# Altium schematic sheet 对射光电接收板-友商方案-手抄版20260609.SchDoc
size A2
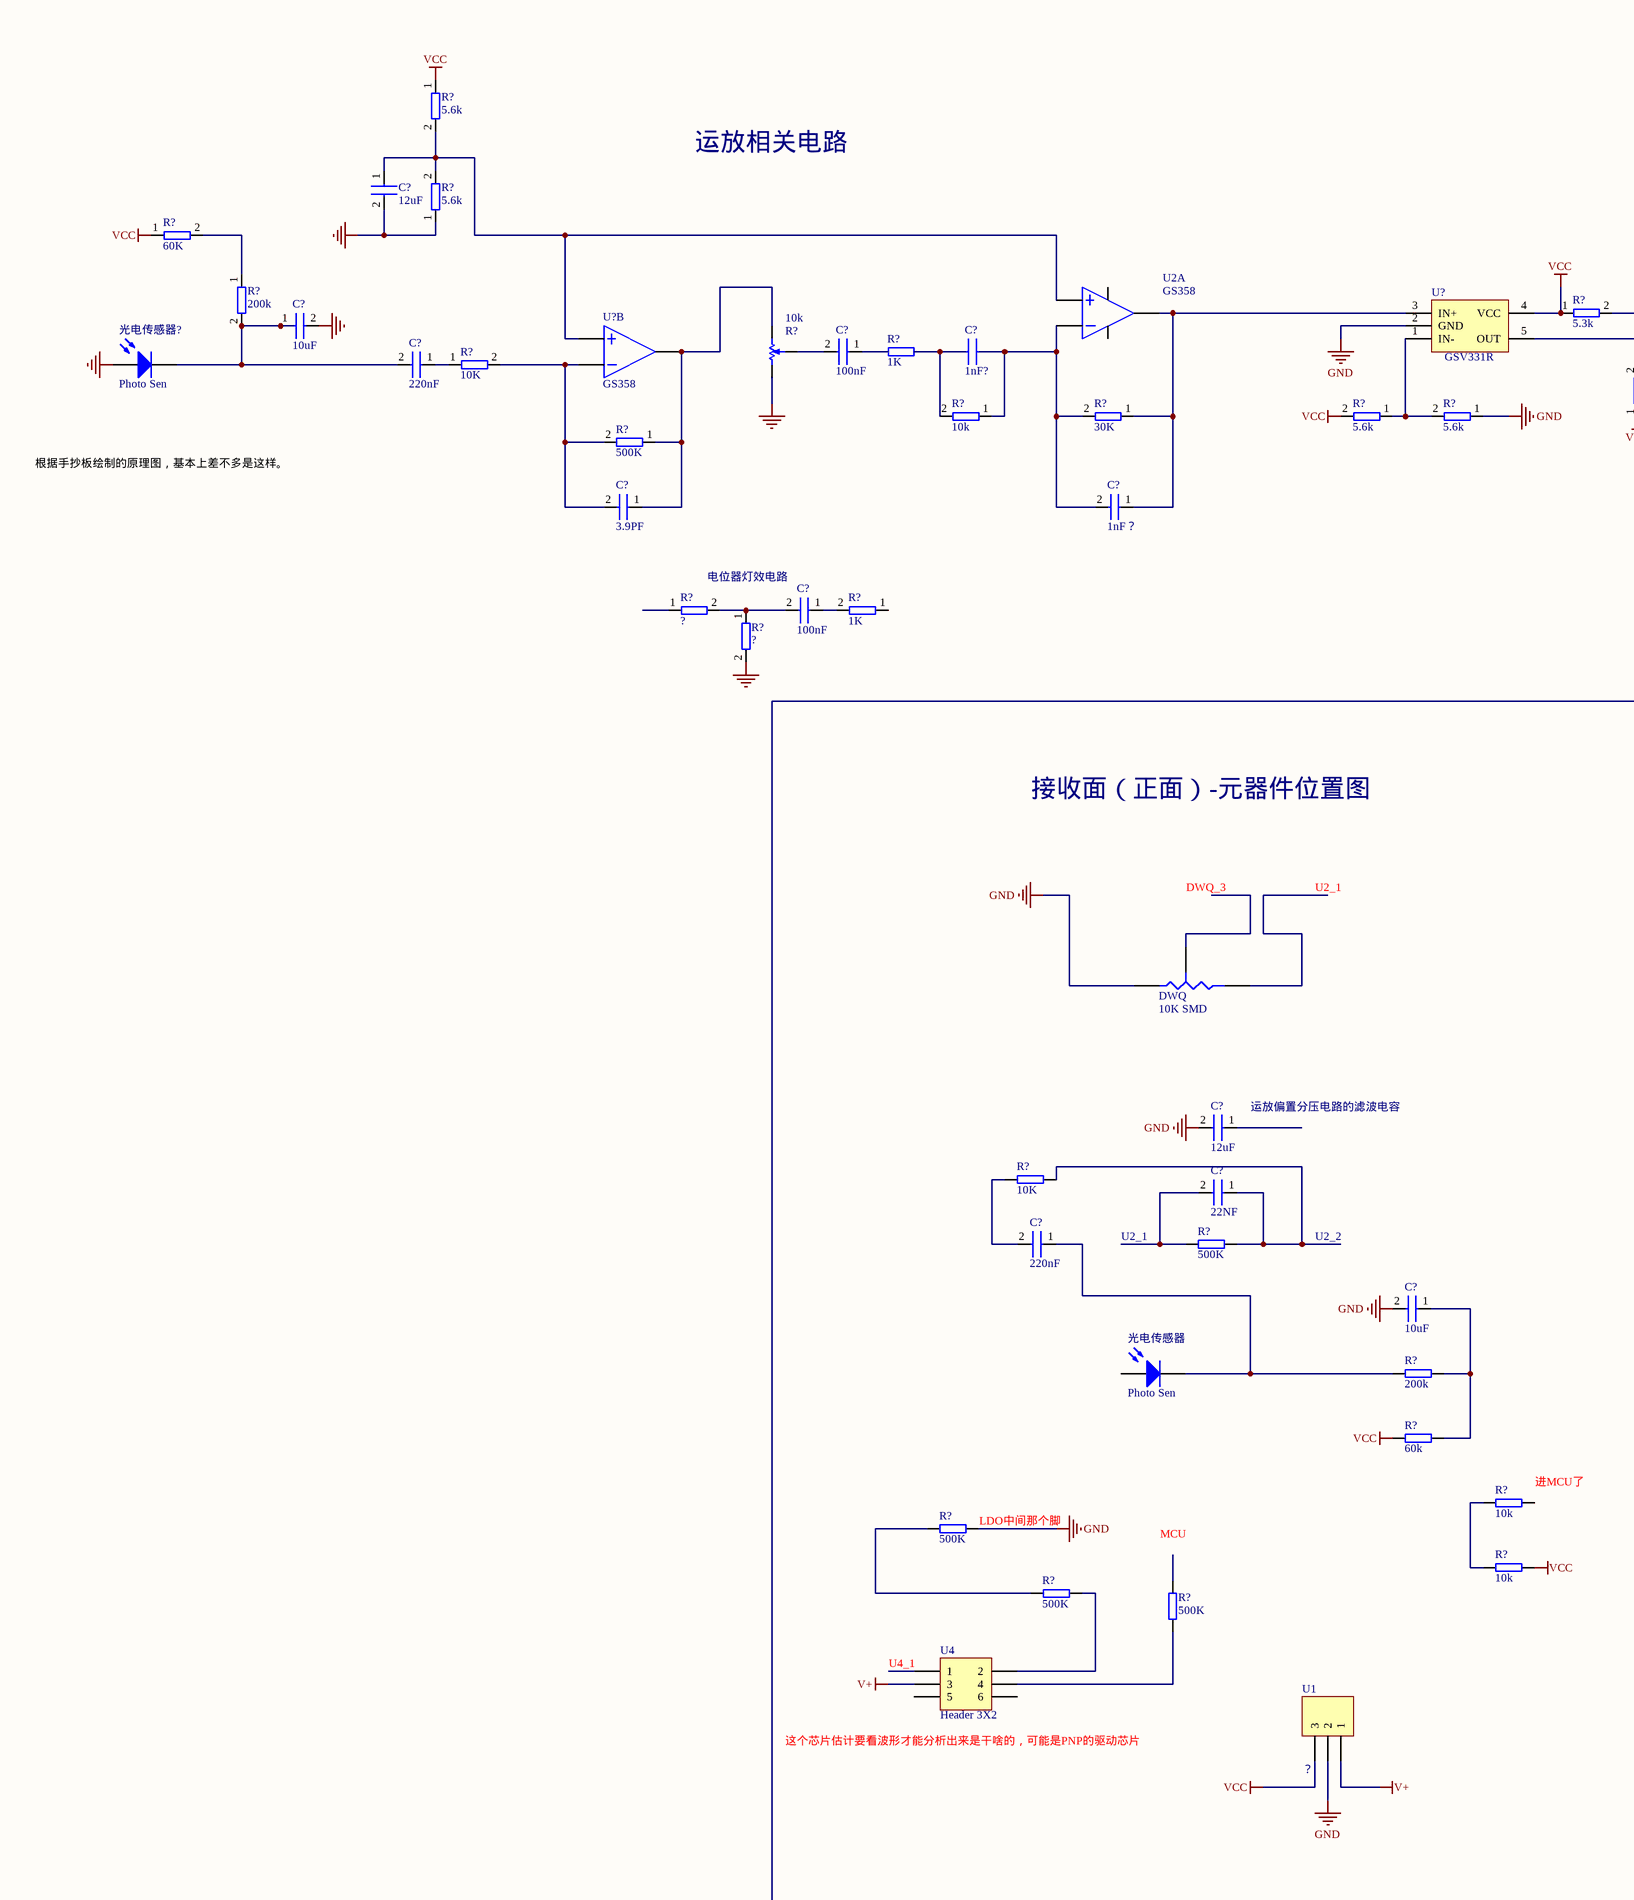
[diagram p0: 对射光电接收板-友商方案-手抄版20260609.SchDoc, left]
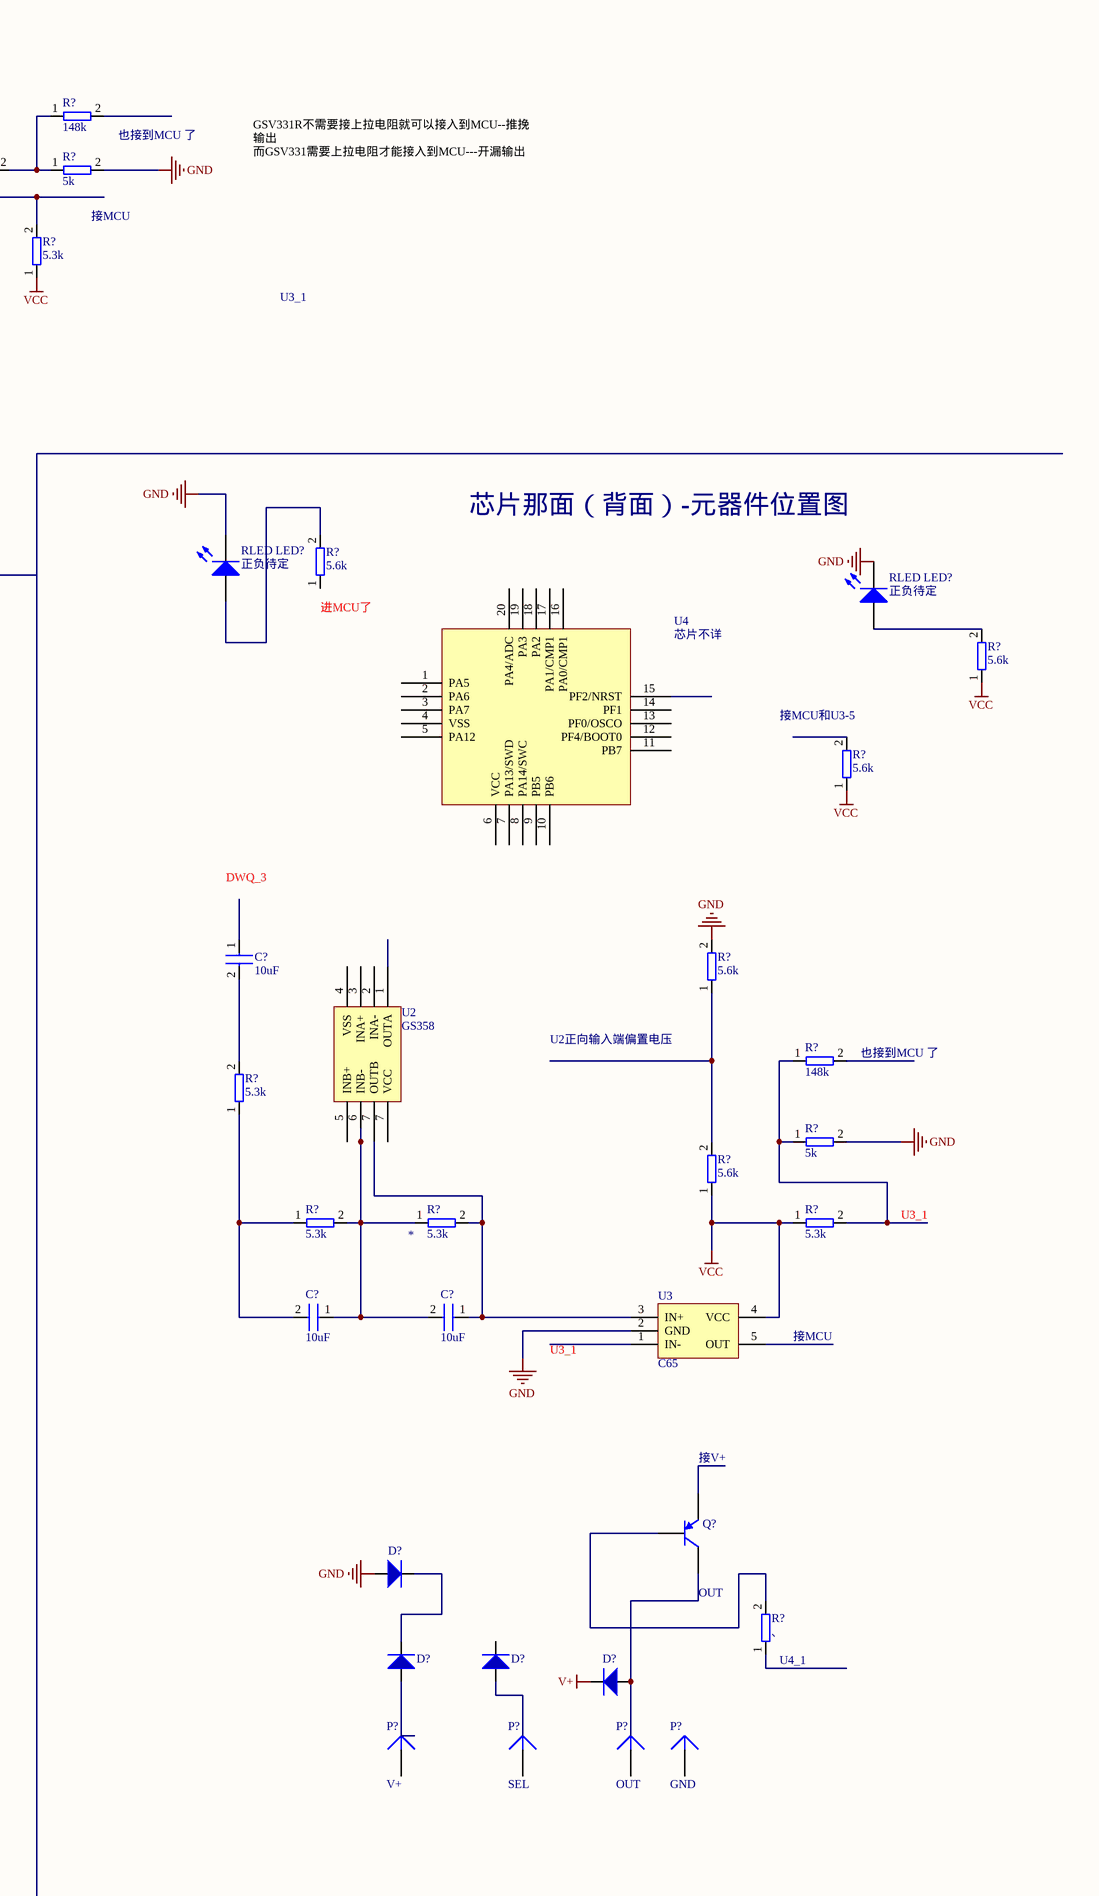
[diagram p1: 对射光电接收板-友商方案-手抄版20260609.SchDoc, right]

## Parts
(Parts that share a designator on the sheet are numbered #1, #2 ... from top to bottom, then left to right.)
5.3k  *  Designator: R?
C?#1  12uF
C?#2  10uF
C?#3  100nF
C?#4  1nF?
C?#5  220nF
C?#6  3.9PF
C?#7  1nF？
C?#8  100nF
C?#9  10uF
C?#10  12uF
C?#11  22NF
C?#12  220nF
C?#13  10uF
C?#14  10uF
C?#15  10uF
D?#1  (no value)
D?#2  (no value)
D?#3  (no value)
D?#4  (no value)
DWQ  value 10K SMD  [VR3]  (hidden comment: Res Tap)
P?#1  V+  [PIN1]
P?#2  SEL  [PIN1]
P?#3  OUT  [PIN1]
P?#4  GND  [PIN1]
Q?  PNP  [SOT-23B_L]  (value not drawn)
R?#1  5.6k
R?#2  5.6k
R?#3  60K
R?#4  148k
R?#5  200k
R?#6  5.3k
R?#7  5k
R?#8  10k  [POT4MM-2]
R?#9  1K
R?#10  10K
R?#11  10k
R?#12  30K
R?#13  5.6k
R?#14  5.6k
R?#15  5.3k
R?#16  500K
R?#17  ?
R?#18  ?
R?#19  1K
R?#20  5.6k
R?#21  5.6k
R?#22  5.6k
R?#23  5.6k
R?#24  148k
R?#25  10K
R?#26  5.3k
R?#27  500K
R?#28  5k
R?#29  5.6k
R?#30  5.3k
R?#31  5.3k
R?#32  200k
R?#33  60k
R?#34  10k
R?#35  500K
R?#36  10k
R?#37  500K
R?#38  500K
R?#39  、
RLED_LED?#1  正负待定  [LED-0]
RLED_LED?#2  正负待定  [LED-0]
U1  ？  [HDR1X3]
U2#1  GS358  [SOP-8]  (part A of 2)
U2#2  GS358
U3  C65  [SC70]
U4#1  芯片不详
U4#2  Header 3X2  [HDR2X3]
U?#1  GSV331R  [SC70]
U?#2  GS358  [SOP-8]  (part B of 2)
光电传感器  Photo Sen  [PIN2]
光电传感器?  Photo Sen  [PIN2]

## Nets
GND: C?#1.2 C?#2.2 C?#10.2 C?#13.2 D?#1.1 DWQ.1(A) R?#2.1 R?#7.2 R?#8.CCW(-) R?#14.1 R?#18.2 R?#23.2 R?#28.2 R?#35.2 RLED_LED?#1.2(K) RLED_LED?#2.2(K) U1.2 U3.2(GND) U?#1.2(GND) 光电传感器?.1(A)
V+: D?#4.2 U1.1 U4#2.3
VCC: R?#1.1 R?#3.1 R?#6.1 R?#13.2 R?#15.1 R?#21.1 R?#22.1 R?#29.1 R?#31.1 R?#33.1 R?#36.2 U1.3 U3.4(VCC) U?#1.4(VCC)
Net5.3k_1: 5.3k.1 C?#14.1 C?#15.2 R?#30.2 U2#2.6(INB-)
Net5.3k_2: 5.3k.2 C?#15.1 U2#2.7(OUTB) U3.3(IN+)
NetC?#1_1: C?#1.1 R?#1.2 R?#2.2 U2#1.3 U?#2.5
NetC?#2_1: C?#2.1 C?#5.2 R?#5.2 光电传感器?.2(K)
NetC?#3_2: C?#3.2 R?#8.W
NetC?#5_1: C?#5.1 R?#10.1
NetC?#6_1: C?#6.1 R?#8.CW(+) R?#16.1 U?#2.7
NetC?#6_2: C?#6.2 R?#10.2 R?#16.2 U?#2.6
NetC?#7_1: C?#7.1 R?#12.1 U2#1.1 U?#1.3(IN+)
NetC?#7_2: C?#7.2 R?#11.1 R?#12.2 U2#1.2
NetC?#8_1: C?#8.1 R?#19.2
NetC?#8_2: C?#8.2 R?#17.2 R?#18.1
NetC?#9_2: C?#9.2 R?#26.2
NetC?#11_1: C?#11.1 R?#25.2 R?#27.2
NetC?#11_2: C?#11.2 R?#27.1
NetC?#12_1: C?#12.1 R?#32.1 光电传感器.2(K)
NetC?#12_2: C?#12.2 R?#25.1
NetC?#13_1: C?#13.1 R?#32.2 R?#33.2
NetC?#14_2: C?#14.2 R?#26.1 R?#30.1
NetD?#1_2: D?#1.2 D?#2.2
NetD?#4_1: D?#4.1 Q?.1(C)
NetQ?_2: Q?.2(B) R?#39.2
NetR?#3_2: R?#3.2 R?#5.1
NetR?#4_1: R?#4.1 R?#6.2 R?#7.1
NetR?#13_1: R?#13.1 R?#14.2 U?#1.1(IN-)
NetR?#15_2: R?#15.2 U?#1.5(OUT)
NetR?#20_2: R?#20.2 RLED_LED?#1.1(A)
NetR?#21_2: R?#21.2 RLED_LED?#2.1(A)
NetR?#23_1: R?#23.1 R?#29.2
NetR?#24_1: R?#24.1 R?#28.1 R?#31.2
NetR?#34_1: R?#34.1 R?#36.1
NetR?#35_1: R?#35.1 R?#37.1
NetR?#37_2: R?#37.2 U4#2.2
NetR?#38_1: R?#38.1 U4#2.4

Not connected (* = marked no-connect by the designer): C?#3 1; C?#4 1 2; C?#9 1; C?#10 1; D?#2 1; D?#3 1 2; DWQ 2(B) 3(TAP); P?#1 1; P?#2 1; P?#3 1; P?#4 1; Q? 3(E); R?#4 2; R?#9 1 2; R?#11 2; R?#17 1; R?#19 1; R?#20 1; R?#22 2; R?#24 2; R?#34 2; R?#38 2; R?#39 1; U2#1 4 8; U2#2 1(OUTA) 2(INA-) 3(INA+) 4(VSS) 5(INB+); U3 1(IN-) 5(OUT); U4#1 1(PA5) 2(PA6) 3(PA7) 4(VSS) 5(PA12) 6(VCC) 7(PA13/SWD) 8(PA14/SWC) 9(PB5) 10(PB6) 11(PB7) 12(PF4/BOOT0) 13(PF0/OSCO) 14(PF1) 15(PF2/NRST) 16(PA0/CMP1) 17(PA1/CMP1) 18(PA2) 19(PA3) 20(PA4/ADC); U4#2 1 5 6; 光电传感器 1(A)

## Notes on the sheet
- 运放相关电路
- (near R?#4) 也接到MCU 了
- (near R?#7) 接MCU
- GSV331R不需要接上拉电阻就可以接入到MCU--推挽输出
  而GSV331需要上拉电阻才能接入到MCU---开漏输出
- U3_1
- (near R?#17) 电位器灯效电路
- 芯片那面（背面）-元器件位置图
- 根据手抄板绘制的原理图，基本上差不多是这样。
- (near R?#20) 进MCU了
- 接收面（正面）-元器件位置图
- (near R?#22) 接MCU和U3-5
- DWQ_3
- U2_1
- (near C?#10) 运放偏置分压电路的滤波电容
- U2正向输入端偏置电压
- (near R?#24) 也接到MCU 了
- U2_2
- (near R?#34) 进MCU了
- 接MCU
- (near R?#35) LDO中间那个脚
- MCU
- 接V+
- (near U4#2) U4_1
- OUT
- (near U4#2) 这个芯片估计要看波形才能分析出来是干啥的，可能是PNP的驱动芯片
- (near R?#39) U4_1

## Library data of the parts
5.3k R?#1-R?#7 R?#9-R?#39 = RES
C?#1-C?#15 = CAP
D?#1-D?#4 = D
DWQ = Res Tap: Tapped Resistor; Sim Note: Enter the Resistance value and the set point into parameter fields.; Set Position: 0.5; Published: 24-Mar-1999; LatestRevisionDate: 17-Jul-2002; LatestRevisionNote: Re-released for DXP Platform.; PackageReference: VR3; Publisher: Altium Limited; PackageDescription: Variable Resistor, Thru-Hole; 3 Leads
P?#1-P?#4 = Plug: LatestRevisionDate: 17-Jul-2002; LatestRevisionNote: Re-released for DXP Platform.; Publisher: Altium Limited
Q? = PNP: PNP Bipolar Transistor; Published: 8-Jun-2000; LatestRevisionDate: 29-May-2009; LatestRevisionNote: IPC-7351 Footprint Added.; PackageVersion: Aug-1999; PackageReference: SOT-23B; Publisher: Altium Limited; PackageDescription: 3-Pin SOT-23 Package 0.95 mm Pitch, 2.4 mm Lead Span
R?#8 = RPot SM: Square Trimming Potentiometer; Published: 17-Dec-2003; DatasheetVersion: Oct-2003; PackageReference: POT4MM-2; Publisher: Altium Limited; PackageDescription: Square Trimming Potentiometer; ComponentLink1Description: Manufacturer Link; ComponentLink1URL: http://bourns.com/2/search.html
RLED_LED?#1 RLED_LED?#2 = LED0: Typical INFRARED GaAs LED; Published: 8-Jun-2000; LatestRevisionDate: 08-Jul-2005; LatestRevisionNote: Mech Layer 1 removed.; PackageReference: LED-0; Publisher: Altium Limited; PackageDescription: LED; 2 Leads
U1 = Header 3: Header, 3-Pin; LatestRevisionDate: 17-Jul-2002; LatestRevisionNote: Re-released for DXP Platform.; Publisher: Altium Limited
U2#1 U?#2 = LM358
U4#1 = PY32F003F16U6
U4#2 = Header 3X2: Header, 3-Pin, Dual row; LatestRevisionDate: 17-Jul-2002; LatestRevisionNote: Re-released for DXP Platform.; Publisher: Altium Limited
U?#1 = C65
光电传感器 光电传感器? = Photo Sen: Photosensitive Diode; Published: 24-Mar-1999; LatestRevisionDate: 17-Jul-2002; LatestRevisionNote: Re-released for DXP Platform.; PackageReference: PIN2; Publisher: Altium Limited